# EAGLE design traning shield (EAGLE 7.2.0)
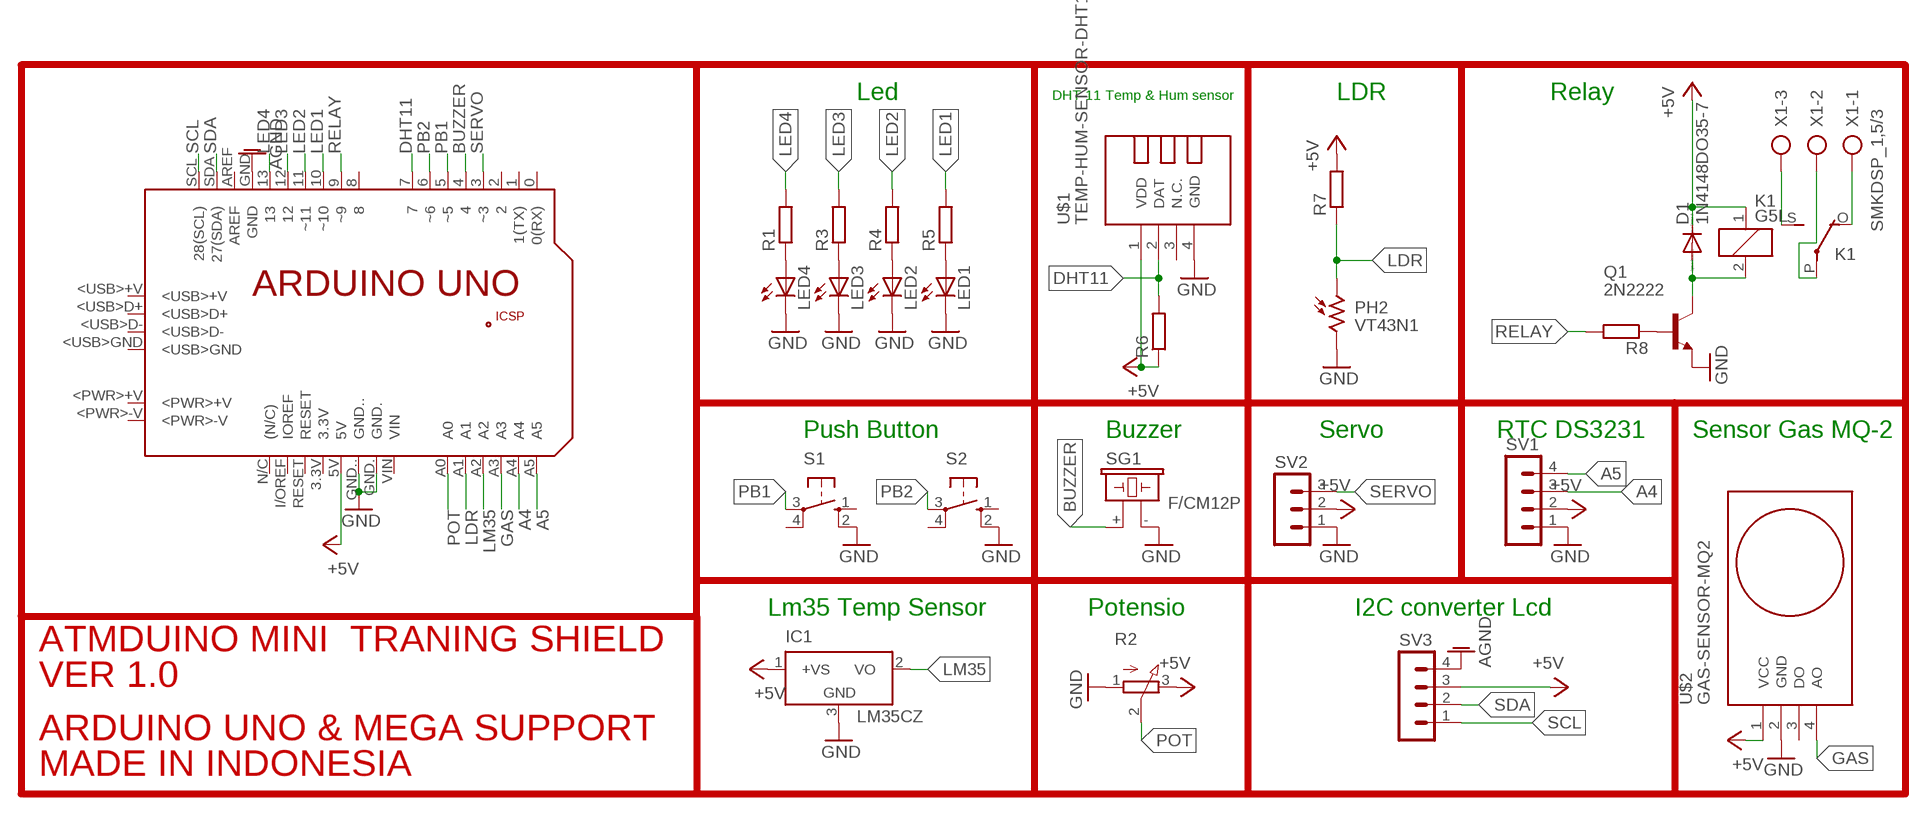
[diagram p0: schematic, sheet 1]

## Parts
D1  1N4148DO35-7  [DO35-7]
IC1  LM35CZ  [TO92]
K1  G5L  [G5LE]
LED1  LED5MM  [LED5MM]
LED2  LED5MM  [LED5MM]
LED3  LED5MM  [LED5MM]
LED4  LED5MM  [LED5MM]
PCB1  ARDUINO_UNO  [ARDUINO_UNO]
PH2  VT43N1  [VT400]
Q1  2N2222  [TO18]
R1  R-EU_0204/5  [0204/5]
R2  3RP/1610N  [3RP/1610N]
R3  R-EU_0204/5  [0204/5]
R4  R-EU_0204/5  [0204/5]
R5  R-EU_0204/5  [0204/5]
R6  R-EU_0204/5  [0204/5]
R7  R-EU_0204/5  [0204/5]
R8  R-EU_0204/5  [0204/5]
S1  10-XX  [B3F-10XX]
S2  10-XX  [B3F-10XX]
SG1  F/CM12P  [F/CM12P]
SV1  MA04-1  [MA04-1]
SV2  MA03-1  [MA03-1]
SV3  MA04-1  [MA04-1]
U$1  TEMP-HUM-SENSOR-DHT11  [TEMP-HUM-SENSOR-DHT11]
U$2  GAS-SENSOR-MQ2  [GAS-SENSOR-MQ2]
X1  SMKDSP_1,5/3  [SMKDSP_1,5/3]

## Nets
+5V: D1.C IC1.1(+VS) K1.1 PCB1.5V R2.3(E) R6.1 R7.2 SV1.2 SV2.2 SV3.3 U$1.1(VDD) U$2.1(VCC)
A4: PCB1.A4 SV1.3
A5: PCB1.A5 SV1.4
AGND: PCB1.GND SV3.4
BUZZER: PCB1.4 SG1.+
DHT11: PCB1.7 R6.2 U$1.2(DAT)
GAS: PCB1.A3 U$2.4(AO)
GND: IC1.3(GND) LED1.K(C) LED2.K(C) LED3.K(C) LED4.K(C) PCB1.GND. PCB1.GND.. PH2.2 Q1.1(E) R2.1(A) S1.2(S1) S2.2(S1) SG1.- SV1.1 SV2.1 U$1.4(GND) U$2.2(GND)
LDR: PCB1.A1 PH2.1 R7.1
LED1: PCB1.10(~10) R5.2
LED2: PCB1.11(~11) R4.2
LED3: PCB1.12 R3.2
LED4: PCB1.13 R1.2
LM35: IC1.2(VO) PCB1.A2
N$1: LED4.A R1.1
N$2: LED3.A R3.1
N$3: LED2.A R4.1
N$4: LED1.A R5.1
N$8: Q1.2(B) R8.1
N$9: D1.A K1.2 Q1.3(C)
N$11: K1.S(2:S) X1.3
N$12: K1.O(2:O) X1.1
N$13: K1.P(2:P) X1.2
PB1: PCB1.5(~5) S1.3(P)
PB2: PCB1.6(~6) S2.3(P)
POT: PCB1.A0 R2.2(S)
RELAY: PCB1.9(~9) R8.2
SCL: PCB1.SCL(28(SCL)) SV3.1
SDA: PCB1.SDA(27(SDA)) SV3.2
SERVO: PCB1.3(~3) SV2.3
Unconnected: PCB1.0(0(RX)) PCB1.1(1(TX)) PCB1.2 PCB1.3.3V PCB1.8 PCB1.+5V PCB1.<PWR>+V PCB1.<PWR>-V PCB1.<USB>+V PCB1.<USB>D+ PCB1.<USB>D- PCB1.<USB>GND PCB1.AREF PCB1.GND_ PCB1.I/OREF(IOREF) PCB1.MISO PCB1.MOSI PCB1.N/C((N/C)) PCB1.RESET PCB1.RESET. PCB1.SCK PCB1.VIN S1.1(S) S1.4(P1) S2.1(S) S2.4(P1) U$1.3(N.C.) U$2.3(DO)

## Notes on the sheet
- Led | DHT 11 Temp & Hum sensor | LDR | Relay
- Push Button | Buzzer | Servo | RTC DS3231 | Sensor Gas MQ-2
- Lm35 Temp Sensor | Potensio | I2C converter Lcd
- ATMDUINO MINI  TRANING SHIELD
- VER 1.0
- ARDUINO UNO & MEGA SUPPORT
- MADE IN INDONESIA

## Library data of the parts
D1 = diode:1N4148: DIODE high speed (Philips)
IC1 = lm35:LM35: Single-Supply Centigrade Temperature Sensor Vout = (10mV/°C x Temp °C) +5mmmV Source: http://www.national.com/ds/LM/LM35.pdf
K1 = relay:G5L: RELAY 1 x switch, 10 A/120 V AC, 8 A/30 V ADC, Omron; OC_FARNELL: unknown; OC_NEWARK: unknown
LED1-LED4 = led:LED: LED OSRAM: - CHIPLED LG R971, LG N971, LY N971, LG Q971, LY Q971, LO R971, LY R971 LH N974, LH R974 LS Q976, LO Q976, LY Q976 LO Q996 - Hyper CHIPLED LW Q18S LB Q993, LB Q99A, LB R99A - SideLED LS A670, LO A670, LY A670, LG A670, LP A670 LB A673, LV A673, LT A673, LW A673 LH A674 LY A675 LS A676, LA A676, LO A676, LY A676, LW A676 LS A679, LY A679, LG A679 - Hyper Micro SIDELED® LS Y876, LA Y876, LO Y876, LY Y876 LT Y87S - SmartLED LW L88C, LW L88S LB L89C, LB L89S, LG L890 LS L89K, LO L89K, LY L89K LS L896, LA L896, LO L896, LY L896 - TOPLED LS T670, LO T670, LY T670, LG T670, LP T670 LSG T670, LSP T670, LSY T670, LOP T670, LYG T670 LG T671, LOG T671, LSG T671 LB T673, LV T673, LT T673, LW T673 LH T674 LS T676, LA T676, LO T676, LY T676, LB T676, LH T676, LSB T676, LW T676 LB T67C, LV T67C, LT T67C, LS T67K, LO T67K, LY T67K, LW E67C LS E67B, LA E67B, LO E67B, LY E67B, LB E67C, LV E67C, LT E67C LW T67C LS T679, LY T679, LG T679 LS T770, LO T770, LY T770, LG T770, LP T770 LB T773, LV T773, LT T773, LW T773 LH T774 LS E675, LA E675, LY E675, LS T675 LS T776, LA T776, LO T776, LY T776, LB T776 LHGB T686 LT T68C, LB T68C - Hyper Mini TOPLED® LB M676 - Mini TOPLED Santana® LG M470 LS M47K, LO M47K, LY M47K Source: http://www.osram.convergy.de LUXEON: - LUMILED® LXK2-PW12-R00, LXK2-PW12-S00, LXK2-PW14-U00, LXK2-PW14-V00 LXK2-PM12-R00, LXK2-PM12-S00, LXK2-PM14-U00 LXK2-PE12-Q00, LXK2-PE12-R00, LXK2-PE12-S00, LXK2-PE14-T00, LXK2-PE14-U00 LXK2-PB12-K00, LXK2-PB12-L00, LXK2-PB12-M00, LXK2-PB14-N00, LXK2-PB14-P00, LXK2-PB14-Q00 LXK2-PR12-L00, LXK2-PR12-M00, LXK2-PR14-Q00, LXK2-PR14-R00 LXK2-PD12-Q00, LXK2-PD12-R00, LXK2-PD12-S00 LXK2-PH12-R00, LXK2-PH12-S00 LXK2-PL12-P00, LXK2-PL12-Q00, LXK2-PL12-R00 Source: www.luxeon.com KINGBRIGHT: KA-3528ASYC Source: www.kingbright.com
PCB1 = Arduino:ARDUINO_UNO: Device for representing an Arduino Uno board with a footprint in an EAGLE design. Created by Dave Young for Element14. More EAGLE documentation at: http://www.element14.com/community/community/knode/cadsoft_eagle
PH2 = photo-elements:VT43N: Photoconductive Cell VT400 Series Source: http://optoelectronics.perkinelmer.com/content/Datasheets/DTS_vt400seriesdatasheet.pdf
Q1 = transistor-npn:2N2222*: NPN Transistor
R1 R3-R8 = resistor:R-EU_: RESISTOR, European symbol
R2 = pot:3RP/1610N: 16mm Potentiometer one level Source: http://www.alphapotentiometers.net/html/16mm_pot_2.html
S1 S2 = switch-omron:10-XX: OMRON SWITCH; MPN: B3F-1000; OC_FARNELL: 176432; OC_NEWARK: 36M3542
SG1 = buzzer:F/CM12P: BUZZER Source: Buerklin; OC_FARNELL: unknown; OC_NEWARK: unknown
SV1 SV3 = con-lstb:MA04-1: PIN HEADER; OC_FARNELL: unknown; OC_NEWARK: unknown
SV2 = con-lstb:MA03-1: PIN HEADER; OC_FARNELL: unknown; OC_NEWARK: unknown
U$1 = diy-modules:TEMP-HUM-SENSOR-DHT11: DHT11 - digital humidity & temperature sensor DHT11 datasheet available here: https://akizukidenshi.com/download/ds/aosong/DHT11.pdf Click here to find device on ebay.com <http://www.ebay.com/sch/dht11+digital+sensor>
U$2 = diy-modules:GAS-SENSOR-MQ2: Gas Sensor based on MQ-2 device Guide describing how to use MQ-2 sensor with Arduino is available here: http://www.instructables.com/id/How-to-use-MQ2-Gas-Sensor-Arduino-Tutorial/ MQ-2 sensor datasheet is available here: http://gas-sensor.ru/pdf/combustible-gas-sensor.pdf Click here to find device on ebay.com <http://www.ebay.com/sch/mq2+sensor+module+smoke>
X1 = con-phoenix-smkdsp:SMKDSP_1,5/3: Printklemme, Nennstrom: 17,5 A, Bemessungsspannung: 250 V, Raster: 5,0 mm Source: http://eshop.phoenixcontact.de .. 1733415.pdf; MF: FARNELL; MPN: 1733583; OC_FARNELL: 3041256; OC_NEWARK: 71C4130

## Board
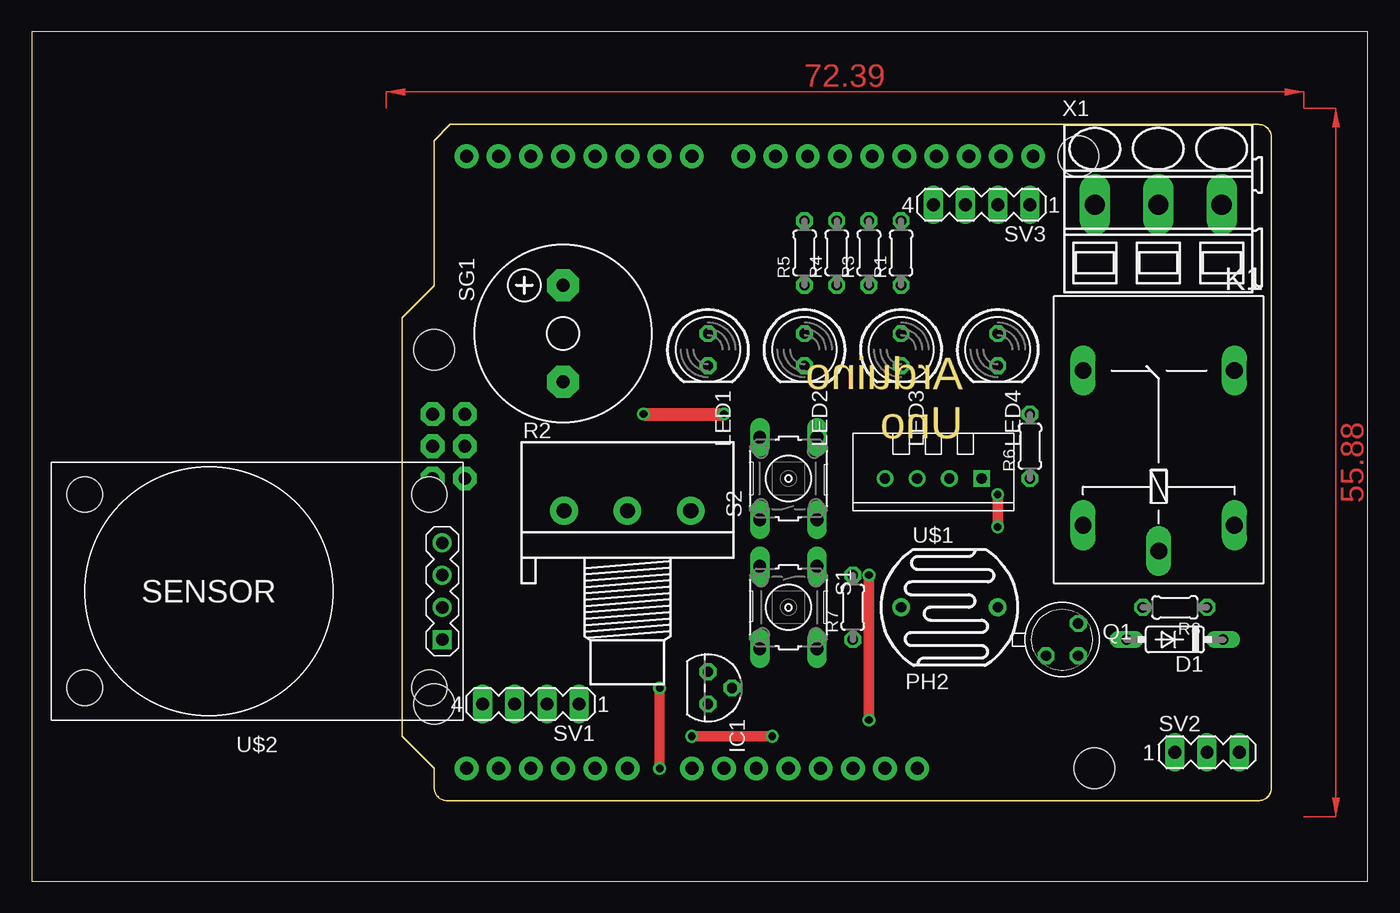
[diagram p1: board, top side]
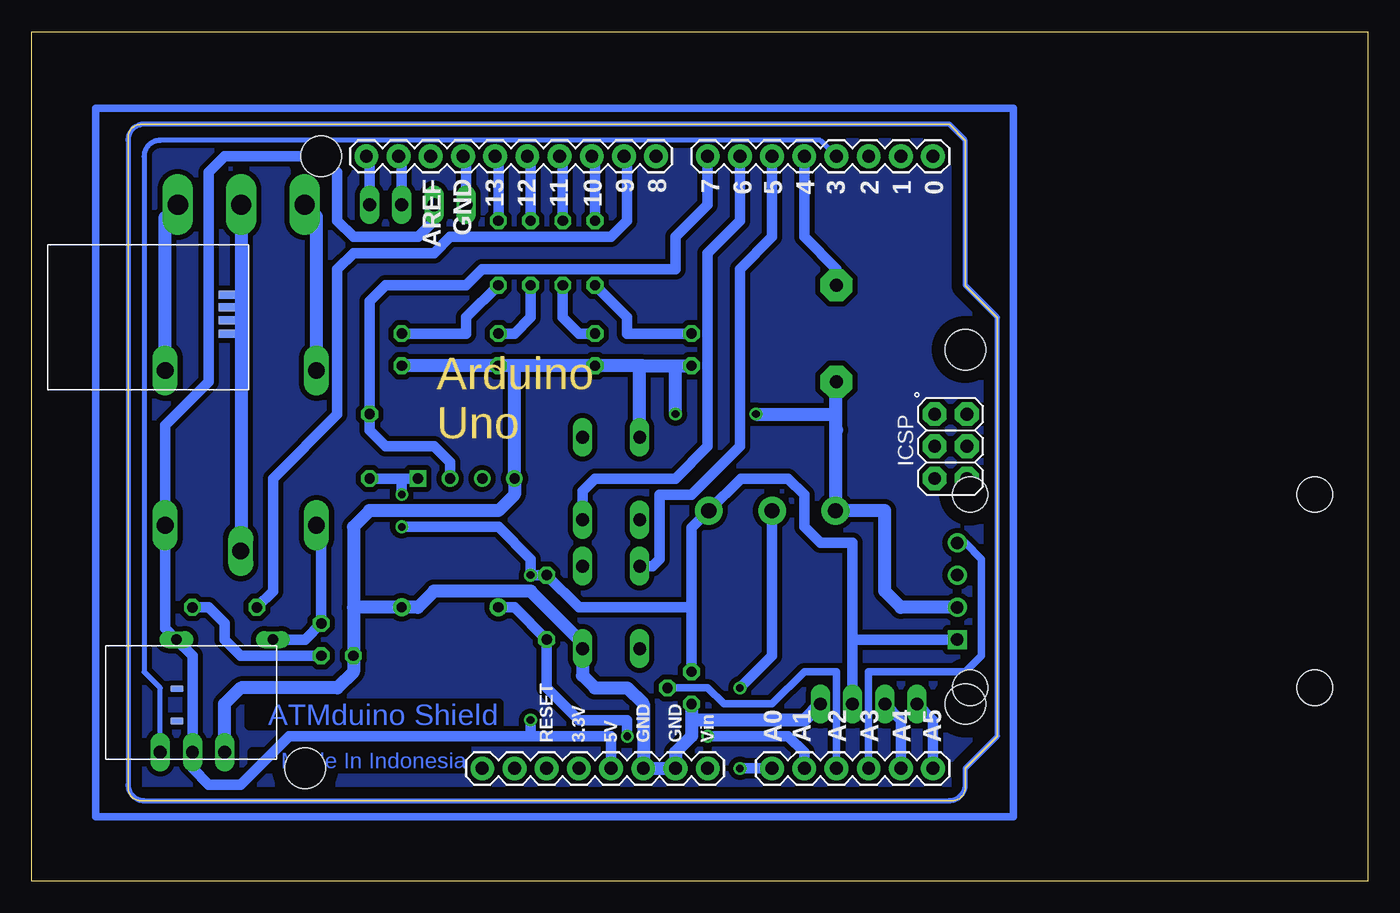
[diagram p2: board, bottom side, seen from below]

Size 105.39 x 66.98 mm. Coordinates in mm from the lower left corner, seen from the top.
Outline: 0,0 105.39,0 105.39,66.98 0,66.98 0,0
Copper layers (1*16): Top 0.035mm / dielectric 1.5mm / Bottom 0.035mm
Design rules "default": minimum track width 10mil, minimum drill 24mil, track to track 8mil, track to pad 8mil, pad to pad 8mil, via to via 8mil, smd to smd 8mil, copper to edge 40mil, drill to drill 8mil, minimum pad ring 10mil, minimum via ring 8mil, stop-mask expansion 4mil, vias tented up to drill 0mil, thermal gap 10mil

### Footprints (pad centres in the part's own frame; a part is rotated, then mirrored left to right if it is on the bottom)
DO35-7 = drill 0.813 long: A 3.81,0; C -3.81,0
TO92 = drill 0.813 octagon: 1 -1.27,0; 2 0,1.905; 3 1.27,0
G5LE = drill 1.321 long: 1 -7.493,-5.969; 2 -7.493,5.969; O 4.699,5.969; P -9.525,0; S 4.699,-5.969
LED5MM = drill 0.813 octagon: A -1.27,0; K 1.27,0
ARDUINO_UNO = drill 1.016 pad 1.88: 0 63.5,50.8; 1 60.96,50.8; 2 58.42,50.8; 3 55.88,50.8; 3.3V 35.56,2.54; 4 53.34,50.8; 5 50.8,50.8; 5V 38.1,2.54; 6 48.26,50.8; 7 45.72,50.8; 8 41.656,50.8; 9 39.116,50.8; 10 36.576,50.8; 11 34.036,50.8; 12 31.496,50.8; 13 28.956,50.8; A0 50.8,2.54; A1 53.34,2.54; A2 55.88,2.54; A3 58.42,2.54; A4 60.96,2.54; A5 63.5,2.54; AREF 23.876,50.8; GND 26.416,50.8; GND. 43.18,2.54; GND.. 40.64,2.54; I/OREF 30.48,2.54; N/C 27.94,2.54; RESET 33.02,2.54; SCL 18.796,50.8; SDA 21.336,50.8; VIN 45.72,2.54 | drill 1.016 pad 1.88 octagon: +5V 66.167,30.48; GND_ 66.167,25.4; MISO 63.627,30.48; MOSI 66.167,27.94; RESET. 63.627,25.4; SCK 63.627,27.94 | smd 1.016 x 0.508: <PWR>+V 3.861,8.814; <PWR>-V 3.861,6.274 | smd 1.27 x 0.635: <USB>+V 7.772,39.878; <USB>D+ 7.772,38.887; <USB>D- 7.772,37.871; <USB>GND 7.772,36.83 | hole 3.2: 66.04,7.62; 66.04,35.56; 15.24,50.8; 13.97,2.54
VT400 = drill 0.8 pad 1.4: 1 -3.81,0; 2 3.81,0
TO18 = drill 0.813 octagon: 1 -1.27,-1.27; 2 1.27,-1.27; 3 1.27,1.27
0204/5 = drill 0.813 octagon: 1 -2.54,0; 2 2.54,0
3RP/1610N = drill 1.2 pad 2.184: 1 -5,0; 2 0,0; 3 5,0
B3F-10XX = drill 1.016 long: 1 -3.251,2.261; 2 3.251,2.261; 3 -3.251,-2.261; 4 3.251,-2.261
F/CM12P = drill 1.016 pad 2.54 octagon: + 3.81,0; - -3.81,0
MA04-1 = drill 1.016 long: 1 -3.81,0; 2 -1.27,0; 3 1.27,0; 4 3.81,0
MA03-1 = drill 1.016 long: 1 -2.54,0; 2 0,0; 3 2.54,0
TEMP-HUM-SENSOR-DHT11 = drill 0.8 square: 1 -3.81,0 | drill 0.8: 2 -1.27,0; 3 1.27,0; 4 3.81,0
GAS-SENSOR-MQ2 = drill 1 square: 1 -14.605,3.81 | drill 1: 2 -14.605,1.27; 3 -14.605,-1.27; 4 -14.605,-3.81 | hole 2.8: -13.589,7.62; -13.589,-7.62; 13.589,-7.62; 13.589,7.62
SMKDSP_1,5/3 = drill 1.6 pad 1.8 long: 1 -2.5,0; 2 2.5,0; 3 7.5,0

### Placement (x,y rotation side)
D1  90.17,19.05 180 top
IC1  53.34,15.24 270 top
K1  88.9,35.56 90 top
LED1  53.34,41.91 270 top
LED2  60.96,41.91 270 top
LED3  68.58,41.91 270 top
LED4  76.2,41.91 270 top
PCB1  97.79,6.35 0 bottom
PH2  72.39,21.59 0 top
Q1  81.28,19.05 0 top
R1  68.58,49.53 90 top
R2  46.99,29.21 0 top
R3  66.04,49.53 90 top
R4  63.5,49.53 90 top
R5  60.96,49.53 90 top
R6  78.74,34.29 90 top
R7  64.77,21.59 90 top
R8  90.17,21.59 180 top
S1  59.69,21.59 270 top
S2  59.69,31.75 90 top
SG1  41.91,43.18 90 top
SV1  39.37,13.97 180 top
SV2  92.71,10.16 0 top
SV3  74.93,53.34 180 top
U$1  71.12,31.75 180 top
U$2  17.78,22.86 180 top
X1  86.36,53.34 0 top

### Tracks (layer width: path | path; a pad name or v marks a point on that pad's centre or on a via)
+5V  (via drill 0.6)
  Top 0.813: v66.04,24.13 v66.04,12.7 | v76.2,30.48 v76.2,27.94
  Bottom 0.813: SV3.3 73.66,52.07 74.93,50.8 80.01,50.8 81.28,52.07 81.28,55.88 82.55,57.15 90.17,57.15 91.44,55.88 91.44,39.37 94.87,35.94 K1.1 94.87,19.94 D1.C 92.71,17.78 SV2.2 92.71,8.89 91.44,7.62 88.9,7.62 85.09,11.43 66.04,11.43 | 53.34,21.59 53.34,27.86 R2.3 49.45,31.75 45.72,31.75 44.45,30.48 44.45,27.94 43.18,26.67 40.64,26.67 40.64,19.05 | IC1.1 53.34,21.59 | 53.34,21.59 62.23,21.59 R7.2 v66.04,24.13 66.04,25.4 68.58,27.94 v76.2,27.94 | v66.04,12.7 66.04,11.43 | SV1.2 40.64,19.05 | R6.1 76.2,31.75 | 76.2,31.75 v76.2,30.48 | U$2.1 40.64,19.05 | U$1.1 76.2,31.75 | 66.04,11.43 59.69,11.43 PCB1.5V
A4
  Bottom 0.813: PCB1.A4 36.83,12.7 SV1.3
A5
  Bottom 0.813: PCB1.A5 34.29,12.7 SV1.4
AGND
  Bottom 0.813: SV3.4 71.12,56.9 PCB1.GND
BUZZER
  Bottom 0.813: SG1.+ 41.91,48.26 44.45,50.8 PCB1.4
DHT11
  Bottom 0.813: U$1.2 72.39,33.02 73.66,34.29 77.47,34.29 78.74,35.56 R6.2 78.74,45.72 77.47,46.99 71.12,46.99 69.85,48.26 54.61,48.26 54.61,50.8 52.07,53.34 PCB1.7
GAS
  Bottom 0.61: U$2.4 31.75,26.67 30.48,25.4 30.48,17.78 31.75,16.51 39.37,16.51 PCB1.A3
GND  (via drill 0.6)
  Top 1.016: v48.26,36.83 v54.61,36.83
  Bottom 1.016: 57.15,40.64 LED2.K 67.31,40.64 | 67.31,40.64 LED3.K LED4.K | S2.2 57.43,40.36 57.15,40.64 | 80.01,21.59 80.01,27.94 78.74,29.21 68.58,29.21 67.31,30.48 U$1.4 67.31,40.64 | 80.01,21.59 Q1.1 80.01,16.51 81.28,15.24 88.9,15.24 90.17,13.97 SV2.1 | 80.01,21.59 PH2.2 74.93,21.59 73.66,22.86 66.04,22.86 61.95,18.77 S1.2 61.95,16.23 60.96,15.24 58.42,15.24 57.15,13.97 PCB1.GND.. PCB1.GND. 54.61,10.16 53.34,11.43 53.34,12.7 | IC1.3 53.34,12.7 | SV1.1 44.45,12.7 53.34,12.7 | SG1.- 41.99,39.37 41.99,36.83 | 41.99,35.64 R2.1 38.1,29.21 38.1,22.86 36.83,21.59 U$2.2 | 57.15,40.64 54.61,40.64 | 54.61,40.64 LED1.K | 41.99,36.83 41.99,35.64 | 41.99,35.64 41.91,35.56 | v48.26,36.83 41.99,36.83 | v54.61,36.83 54.61,40.64
LDR  (via drill 0.6)
  Top 0.813: v58.42,11.43 v52.07,11.43
  Bottom 0.813: PH2.1 67.31,21.59 R7.1 64.77,15.24 62.23,12.7 58.42,12.7 v58.42,11.43 | v52.07,11.43 45.72,11.43 44.45,10.16 PCB1.A1
LED1
  Bottom 0.813: R5.2 60.96,56.9 PCB1.10
LED2
  Bottom 0.813: R4.2 63.5,56.9 PCB1.11
LED3
  Bottom 0.813: R3.2 66.04,56.9 PCB1.12
LED4
  Bottom 0.813: R1.2 68.58,56.9 PCB1.13
LM35
  Bottom 0.61: IC1.2 52.07,15.24 50.8,13.97 46.99,13.97 44.45,16.51 41.91,16.51 PCB1.A2
N$1
  Bottom 0.813: LED4.A 71.12,43.18 71.12,44.45 R1.1
N$2
  Bottom 0.813: R3.1 66.04,44.45 67.31,43.18 LED3.A
N$3
  Bottom 0.813: R4.1 63.5,44.45 62.23,43.18 LED2.A
N$4
  Bottom 0.813: LED1.A 58.42,43.18 58.42,44.45 R5.1
N$5
  pour Bottom (isolate 0.406): 33.02,59.69 96.52,59.69 arc-90 97.79,58.42 97.79,7.62 arc-90 96.52,6.35 33.02,6.35 arc-90 31.75,7.62 31.75,8.89 29.21,11.43 29.21,44.45 31.75,46.99 31.75,58.42
N$7
  Bottom 0.406: 33.02,59.69 34.29,59.69 35.56,59.69 96.52,59.69 arc-90 97.79,58.42 97.79,7.62 arc-90 96.52,6.35 33.02,6.35 arc-90 31.75,7.62 31.75,8.89 29.21,11.43 29.21,44.45 31.75,46.99 31.75,58.42 33.02,59.69
N$8
  Bottom 0.813: Q1.2 88.9,17.78 90.17,19.05 90.17,20.32 91.44,21.59 R8.1
N$9
  Bottom 0.813: K1.2 82.55,27.69 Q1.3 83.82,19.05 D1.A
N$11
  Bottom 1.016: K1.S 94.87,52.33 X1.3
N$12
  Bottom 1.016: K1.O 82.93,52.41 X1.1
N$13
  Bottom 1.016: X1.2 88.86,26.07 K1.P
N$14
  Bottom 0.61: 100.33,60.96 100.33,5.08 27.94,5.08 27.94,60.96 100.33,60.96
PB1
  Bottom 0.813: S1.3 56.44,24.84 55.88,25.4 55.88,30.48 53.34,30.48 49.53,34.29 49.53,48.26 46.99,50.8 PCB1.5
PB2
  Bottom 0.813: S2.3 61.95,30.76 60.96,31.75 54.61,31.75 52.07,34.29 52.07,49.53 49.53,52.07 PCB1.6
POT  (via drill 0.6)
  Top 0.813: v49.53,8.89 v49.53,15.24
  Bottom 0.813: PCB1.A0 v49.53,8.89 | v49.53,15.24 46.99,17.78 R2.2
RELAY
  Bottom 0.813: R8.2 86.36,22.86 86.36,31.75 81.28,36.83 81.28,48.26 80.01,49.53 73.66,49.53 72.39,50.8 59.69,50.8 58.42,52.07 58.42,56.9 PCB1.9
SCL
  Bottom 0.813: SV3.1 78.74,56.9 PCB1.SCL
SDA
  Bottom 0.813: SV3.2 76.2,56.9 PCB1.SDA
SERVO
  Bottom 0.406: PCB1.3 43.18,58.42 95.25,58.42 arc-90 96.52,57.15 96.52,16.51 95.25,15.24 SV2.3
(copper drawn outside any net)
  shapes: Top area x2

### Text on the board
Bottom: ATMduino Shield | Made In Indonesia